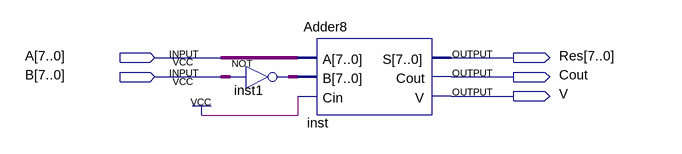
[diagram p0: schematic sheet]
// Quartus schematic Sub8S.bdf as structural Verilog: 2 symbols, 5 pins
module Sub8S (
  input  [7:0] A,
  input  [7:0] B,
  output [7:0] Res,
  output Cout,
  output V
);

  wire [7:0] inst1_out;

  assign inst1_out = ~B;  // NOT inst1, 8 bits wide
  Adder8 inst (.A(A), .B(inst1_out), .Cin(1'b1), .S(Res), .Cout(Cout), .V(V));
endmodule
